# Altium schematic sheet power.SchDoc
size A; SheetNumber: 4; SheetTotal: 4
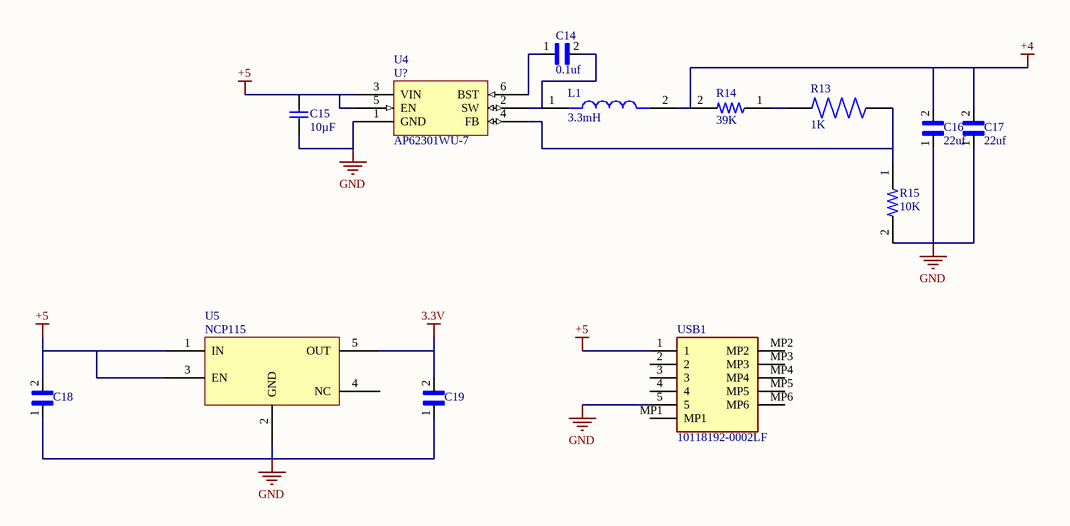
[diagram p0: power.SchDoc]

## Parts
C14  value 0.1uf  [CAPC1608X90N]  (hidden comment: 06033G104ZAT4A)
C15  10µF  [CAP_0603]
C16  value 22uf  [CAPC1608X100N]  (hidden comment: GRM188R60G226MEA0D)
C17  value 22uf  [CAPC1608X100N]  (hidden comment: GRM188R60G226MEA0D)
C18  06033G104ZAT4A  [CAPC1608X90N]  (value not drawn)
C19  06033G104ZAT4A  [CAPC1608X90N]  (value not drawn)
L1  value 3.3mH  [IND_VLS6045AF-3R3N]  (hidden comment: VLS6045AF-3R3N)
R13  value 1K  [RESC1608X55N]  (hidden comment: CR0603-FX-1001ELF)
R14  value 39K  [RESC1607X60N]  (hidden comment: RC0603FR-0739KL)
R15  value 10K  [RESC1607X60N]  (hidden comment: RC0603FR-0710KL)
U4  AP62301WU-7  [AP62301WU-7]
U5  NCP115ASN330T2G  [NCP115]  (value not drawn)
USB1  10118192-0002LF  [101181920002LF]

## Nets
3.3V: C19.2 U5.5(OUT)
+4: C16.2 C17.2 L1.2 R14.2
+5: C15.1 C18.2 U4.3(VIN) U4.5(EN) U5.1(IN) U5.3(EN) USB1.1
GND: C15.2 C16.1 C17.1 C18.1 C19.1 R15.2 U4.1(GND) U5.2(GND) USB1.5
NetC14_1: C14.1 U4.6(BST)
NetC14_2: C14.2 L1.1 U4.2(SW)
NetR13_1: R13.1 R15.1 U4.4(FB)
NetR13_2: R13.2 R14.1

Not connected (* = marked no-connect by the designer): U5 4(NC); USB1 2 3 4 MP1 MP2 MP3 MP4 MP5 MP6

## Notes on the sheet
- (in symbol AP62301WU-7) U?
- (in symbol NCP115ASN330T2G) NCP115

## Library data of the parts
C14 C18 C19 = 06033G104ZAT4A: Cap Ceramic 0.1uF 25V Y5V -20% to 80% SMD 0603 85C T/R; MF: {'manufacturer': u'AVX'}; Availability: Unavailable; MP: 06033G104ZAT4A; Price: None; Package: None
  C18 C19: Value: *
C15 = CL10A106KP8NNNC: 10µF 10V Ceramic Capacitor X5R 0603 (1608 Metric) 0.063" L x 0.031" W (1.60mm x 0.80mm); Manufacturer: Samsung Electronics; Supplier 1: Digi-Key; Value: 10µF; Supplier Part Number 1: 1276-1192-1-ND; Part Number: CL10A106KP8NNNC
C16 C17 = GRM188R60G226MEA0D: Cap Ceramic 22uF 4V X5R 20% SMD 0603 85C T/R; MF: {'manufacturer': u'Murata'}; Price: None; Availability: Unavailable; MP: GRM188R60G226MEA0D; Package: None
L1 = VLS6045AF-3R3N: MF: {'manufacturer': u'TDK Corporation'}; Package: None; Availability: Unavailable; MP: VLS6045AF-3R3N; Price: None
R13 = CR0603-FX-1001ELF: Resistor; Thick Film; Res 1 Kilohms; Pwr-Rtg 0.1 W; Tol 1%; SMT; 0603; MF: {'manufacturer': u'Bourns'}; Availability: Unavailable; MP: CR0603-FX-1001ELF; Price: None; Package: None
R14 = RC0603FR-0739KL: Res Thick Film 1.6 x 0.8 mm 39K Ohm 1% 0.1W(1/10W) 100ppm/ C Molded SMD Paper T/R; MF: {'manufacturer': u'Yageo'}; Price: None; Availability: Unavailable; MP: RC0603FR-0739KL; Package: None
R15 = RC0603FR-0710KL: YAGEO RC0603FR-0710KL / RESISTOR 10K 1/10W 1% 0603 YAG; MF: {'manufacturer': u'Yageo'}; Availability: Unavailable; MP: RC0603FR-0710KL; Price: None; Package: None
USB1 = 10118192-0002LF: Connector; Manufacturer_Name: Amphenol Communication Solutions; Datasheet Link: https://www.amphenol-cs.com/media/wysiwyg/files/drawing/10118192.pdf; Height: 3.05mm; Manufacturer_Part_Number: 10118192-0002LF; Mouser Part Number: 649-10118192-0002LF; Mouser Price/Stock: https://www.mouser.co.uk/ProductDetail/Amphenol-FCI/10118192-0002LF?qs=KVgMXE4aH4nIkuWlMxQzog%3D%3D; Arrow Part Number: 10118192-0002LF; Arrow Price/Stock: https://www.arrow.com/en/products/10118192-0002lf/amphenol-fci?region=nac